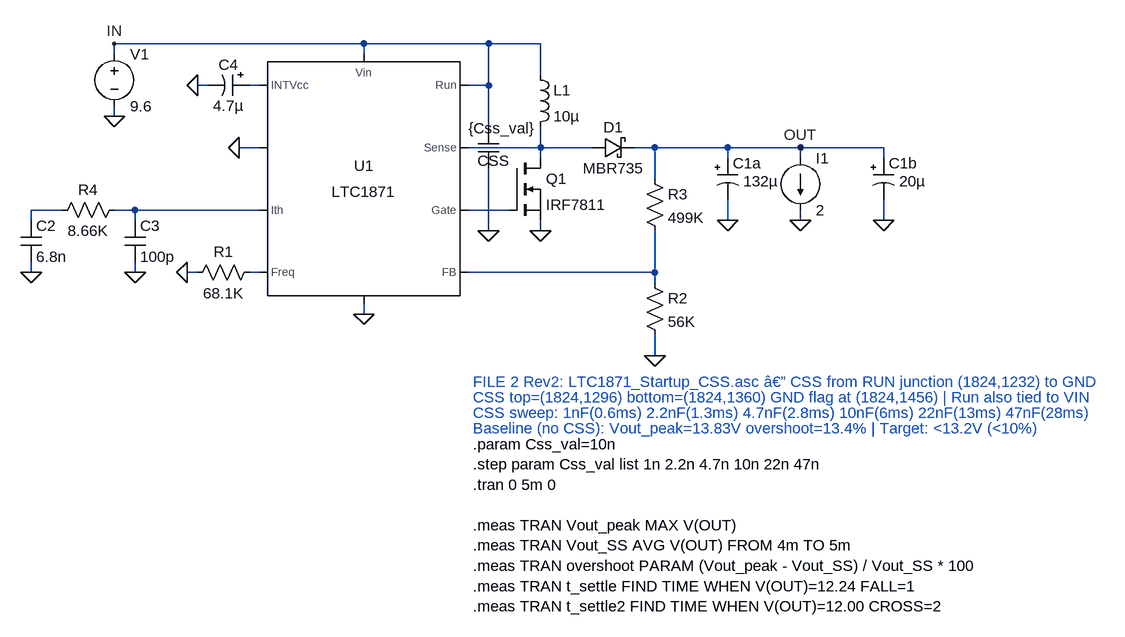
[diagram p0: schematic LTC1871_Startup_CSS_1.asc]
LTC1871_Startup_CSS_1.asc, the LTspice schematic file:
Version 4.1
SHEET 1 5664 2264
WIRE 1632 1168 1248 1168
WIRE 1824 1168 1632 1168
WIRE 1904 1168 1824 1168
WIRE 1248 1184 1248 1168
WIRE 1632 1184 1632 1168
WIRE 1904 1216 1904 1168
WIRE 1392 1232 1376 1232
WIRE 1472 1232 1456 1232
WIRE 1824 1232 1824 1168
WIRE 1824 1232 1792 1232
WIRE 1248 1280 1248 1264
WIRE 1824 1296 1824 1232
WIRE 1472 1328 1440 1328
WIRE 1904 1328 1904 1296
WIRE 1904 1328 1792 1328
WIRE 1984 1328 1904 1328
WIRE 2080 1328 2048 1328
WIRE 2192 1328 2080 1328
WIRE 2304 1328 2192 1328
WIRE 2432 1328 2304 1328
WIRE 1904 1344 1904 1328
WIRE 2192 1344 2192 1328
WIRE 2304 1344 2304 1328
WIRE 2432 1344 2432 1328
WIRE 2080 1376 2080 1328
WIRE 1168 1424 1120 1424
WIRE 1280 1424 1248 1424
WIRE 1472 1424 1280 1424
WIRE 1856 1424 1792 1424
WIRE 1120 1440 1120 1424
WIRE 1280 1440 1280 1424
WIRE 2192 1440 2192 1408
WIRE 2304 1440 2304 1424
WIRE 2432 1440 2432 1408
WIRE 1824 1456 1824 1360
WIRE 1904 1456 1904 1440
WIRE 1120 1520 1120 1504
WIRE 1280 1520 1280 1504
WIRE 1376 1520 1360 1520
WIRE 1472 1520 1456 1520
WIRE 2080 1520 2080 1456
WIRE 2080 1520 1792 1520
WIRE 2080 1536 2080 1520
WIRE 1632 1584 1632 1568
WIRE 2080 1648 2080 1616
FLAG 1904 1456 0
FLAG 1360 1520 0
FLAG 1632 1584 0
FLAG 2192 1440 0
FLAG 1280 1520 0
FLAG 1120 1520 0
FLAG 2304 1440 0
FLAG 2432 1440 0
FLAG 1248 1280 0
FLAG 1440 1328 0
FLAG 1376 1232 0
FLAG 2304 1328 OUT
FLAG 1248 1168 IN
FLAG 1824 1456 0
FLAG 2080 1648 0
SYMBOL NMOS 1856 1344 R0
SYMATTR InstName Q1
SYMATTR Value IRF7811
SYMBOL RES 1472 1504 R90
WINDOW 0 0 56 VBottom 2
WINDOW 3 32 56 VTop 2
SYMATTR InstName R1
SYMATTR Value 68.1K
SYMBOL res 2064 1520 R0
SYMATTR InstName R2
SYMATTR Value 56K
SYMBOL res 2064 1360 R0
SYMATTR InstName R3
SYMATTR Value 499K
SYMBOL ind 1888 1200 R0
SYMATTR InstName L1
SYMATTR Value 10µ
SYMBOL schottky 1984 1344 R270
WINDOW 0 32 32 VTop 2
WINDOW 3 0 32 VBottom 2
SYMATTR InstName D1
SYMATTR Value MBR735
SYMBOL polcap 2176 1344 R0
WINDOW 40 27 64 Left 2
WINDOW 3 40 36 Left 2
SYMATTR Value 132µ
SYMATTR InstName C1a
SYMATTR SpiceLine Rser=0.00021
SYMBOL polcap 2416 1344 R0
WINDOW 40 27 64 Left 2
WINDOW 3 40 36 Left 2
SYMATTR Value 20µ
SYMATTR InstName C1b
SYMATTR SpiceLine Rser=0.00125
SYMBOL res 1264 1408 R90
WINDOW 0 0 56 VBottom 2
WINDOW 3 32 56 VTop 2
SYMATTR InstName R4
SYMATTR Value 8.66K
SYMBOL cap 1104 1440 R0
SYMATTR InstName C2
SYMATTR Value 6.8n
SYMBOL cap 1264 1440 R0
SYMATTR InstName C3
SYMATTR Value 100p
SYMBOL POWERPRODUCTS\\LTC1871 1632 1376 R0
SYMATTR InstName U1
SYMBOL VOLTAGE 1248 1168 R0
WINDOW 123 0 0 Left 0
WINDOW 39 0 0 Left 0
SYMATTR InstName V1
SYMATTR Value 9.6
SYMBOL polcap 1456 1216 R90
WINDOW 0 0 32 VBottom 2
WINDOW 3 32 32 VTop 2
SYMATTR InstName C4
SYMATTR Value 4.7µ
SYMBOL current 2304 1344 R0
WINDOW 123 0 0 Left 0
WINDOW 39 0 0 Left 0
SYMATTR InstName I1
SYMATTR Value 2
SYMBOL cap 1808 1296 R0
WINDOW 0 -1 52 Left 2
WINDOW 3 87 2 Right 2
SYMATTR InstName CSS
SYMATTR Value {Css_val}
TEXT 1800 1784 Left 2 !.param Css_val=10n\n.step param Css_val list 1n 2.2n 4.7n 10n 22n 47n\n.tran 0 5m 0\n \n.meas TRAN Vout_peak MAX V(OUT)\n.meas TRAN Vout_SS AVG V(OUT) FROM 4m TO 5m\n.meas TRAN overshoot PARAM (Vout_peak - Vout_SS) / Vout_SS * 100\n.meas TRAN t_settle FIND TIME WHEN V(OUT)=12.24 FALL=1\n.meas TRAN t_settle2 FIND TIME WHEN V(OUT)=12.00 CROSS=2
TEXT 1800 1688 Left 2 ;FILE 2 Rev2: LTC1871_Startup_CSS.asc â€” CSS from RUN junction (1824,1232) to GND
TEXT 1800 1712 Left 2 ;CSS top=(1824,1296) bottom=(1824,1360) GND flag at (1824,1456) | Run also tied to VIN
TEXT 1800 1736 Left 2 ;CSS sweep: 1nF(0.6ms) 2.2nF(1.3ms) 4.7nF(2.8ms) 10nF(6ms) 22nF(13ms) 47nF(28ms)
TEXT 1800 1760 Left 2 ;Baseline (no CSS): Vout_peak=13.83V overshoot=13.4% | Target: <13.2V (<10%)

The netlist it stands for:
* LTC1871_Startup_CSS_1.asc
M§Q1 N002 N005 0 0 IRF7811
R1 N006 0 68.1K
R2 N007 0 56K
R3 OUT N007 499K
L1 IN N002 10µ
D1 N002 OUT MBR735
C1a OUT 0 132µ Rser=0.00021
C1b OUT 0 20µ Rser=0.00125
R4 N004 N003 8.66K
C2 N003 0 6.8n
C3 N004 0 100p
X§U1 IN N004 N007 N006 0 0 N005 N001 IN N002 LTC1871  ; pins Run Ith FB Freq ? ? Gate INTVcc Vin Sense
V1 IN 0 9.6
C4 N001 0 4.7µ
I1 OUT 0 2
CSS IN 0 {Css_val}
.model D D
.lib standard.dio
.model NMOS NMOS
.model PMOS PMOS
.lib standard.mos
.param Css_val=10n
.step param Css_val list 1n 2.2n 4.7n 10n 22n 47n
.tran 0 5m 0
.meas TRAN Vout_peak MAX V(OUT)
.meas TRAN Vout_SS AVG V(OUT) FROM 4m TO 5m
.meas TRAN overshoot PARAM (Vout_peak - Vout_SS) / Vout_SS * 100
.meas TRAN t_settle FIND TIME WHEN V(OUT)=12.24 FALL=1
.meas TRAN t_settle2 FIND TIME WHEN V(OUT)=12.00 CROSS=2
* FILE 2 Rev2: LTC1871_Startup_CSS.asc â€” CSS from RUN junction (1824,1232) to GND
* CSS top=(1824,1296) bottom=(1824,1360) GND flag at (1824,1456) | Run also tied to VIN
* CSS sweep: 1nF(0.6ms) 2.2nF(1.3ms) 4.7nF(2.8ms) 10nF(6ms) 22nF(13ms) 47nF(28ms)
* Baseline (no CSS): Vout_peak=13.83V overshoot=13.4% | Target: <13.2V (<10%)
.lib LTC1871.sub
.backanno
.end